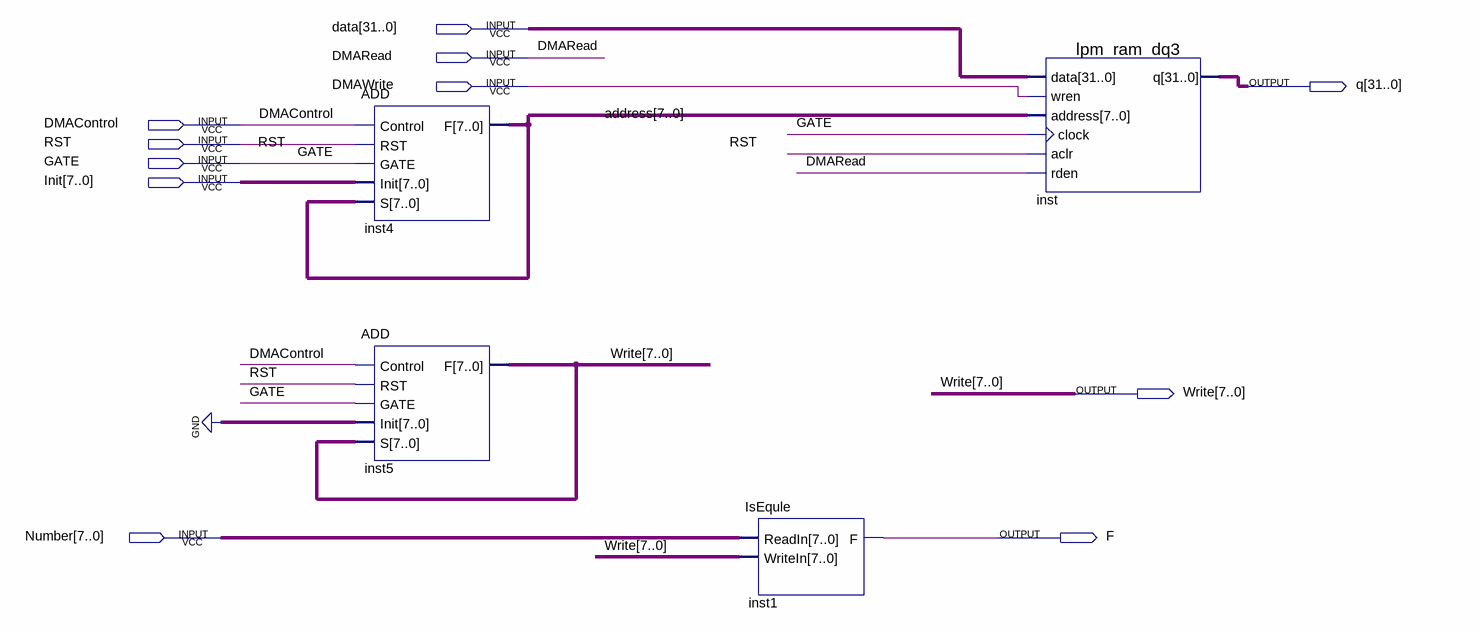
[diagram p0: schematic sheet]
// Quartus schematic MDMA.bdf as structural Verilog: 4 symbols, 11 pins
module MDMA (
  input  [31:0] data,
  input  DMARead,
  input  DMAWrite,
  input  DMAControl,
  input  RST,
  input  GATE,
  input  [7:0] Init,
  input  [7:0] Number,
  output [31:0] q,
  output [7:0] Write,
  output F
);

  wire [7:0] address;

  ADD inst4 (.Control(DMAControl), .RST(RST), .GATE(GATE), .Init(Init), .S(address), .F(address));
  ADD inst5 (.Control(DMAControl), .RST(RST), .GATE(GATE), .Init({8{1'b0}}), .S(Write), .F(Write));
  IsEqule inst1 (.ReadIn(Number), .WriteIn(Write), .F(F));
  lpm_ram_dq3 inst (.data(data), .wren(DMAWrite), .address(address), .clock(GATE), .aclr(RST), .rden(DMARead), .q(q));
endmodule
